# EAGLE schematic Day0_Yulian Deni_13215034 (EAGLE 7.5.0)
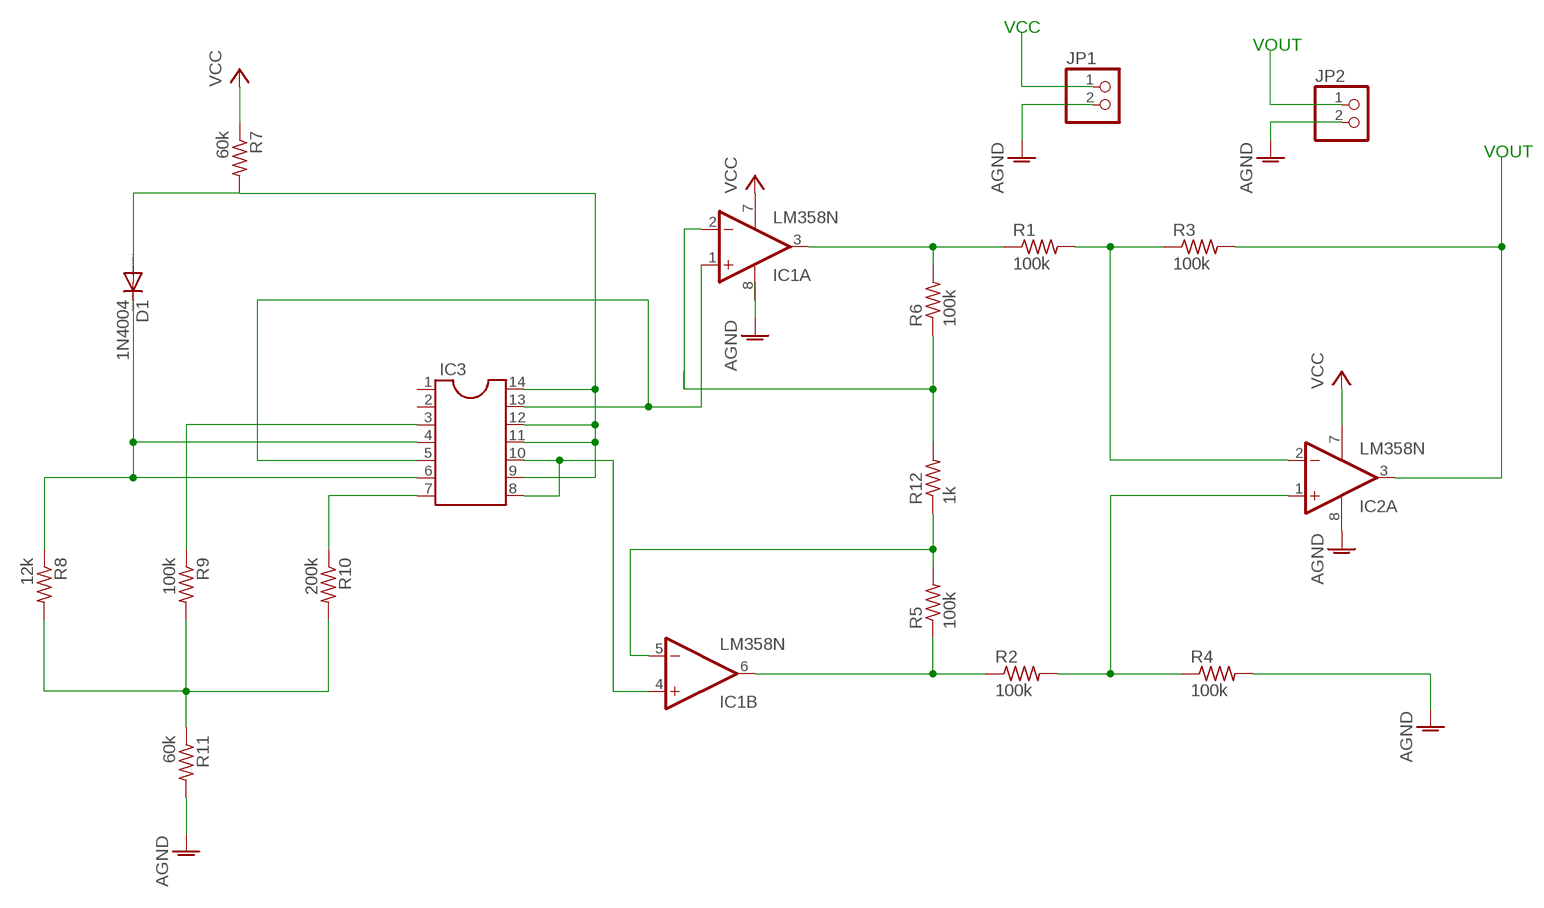
[diagram p0: schematic, sheet 1]

## Parts
D1  1N4004  [DO41-10]
IC1  LM358N  [DIL08]
IC2  LM358N  [DIL08]
IC3  DIL14  [DIL14]
JP1  PINHD-1X2  [1X02]
JP2  PINHD-1X2  [1X02]
R1  100k  R-US_0204/7  [0204/7]
R2  100k  R-US_0204/7  [0204/7]
R3  100k  R-US_0204/7  [0204/7]
R4  100k  R-US_0204/7  [0204/7]
R5  100k  R-US_0204/7  [0204/7]
R6  100k  R-US_0204/7  [0204/7]
R7  60k  R-US_0204/7  [0204/7]
R8  12k  R-US_0204/7  [0204/7]
R9  100k  R-US_0204/7  [0204/7]
R10  200k  R-US_0204/7  [0204/7]
R11  60k  R-US_0204/7  [0204/7]
R12  1k  R-US_0204/7  [0204/7]

## Nets
AGND: IC2.8(P:V-) JP1.2 JP2.2 R4.2 R11.2
N$1: D1.A IC3.9 IC3.11 IC3.12 IC3.14 R7.2
N$2: D1.C IC3.4 IC3.6 R8.1
N$3: IC3.7 R10.1
N$4: IC1.1(A:+IN) IC3.5 IC3.13
N$5: IC3.3 R9.1
N$6: R8.2 R9.2 R10.2 R11.1
N$7: IC1.4(B:+IN) IC3.8 IC3.10
N$8: IC1.3(A:OUT) R1.1 R6.2
N$9: R6.1 R12.2
N$10: IC1.5(B:-IN) R5.2 R12.1
N$11: IC1.6(B:OUT) R2.1 R5.1
N$12: IC2.2(A:-IN) R1.2 R3.1
N$13: IC1.2(A:-IN)
N$14: IC2.1(A:+IN) R2.2 R4.1
N$15: IC2.3(A:OUT) R3.2
N$16: JP1.1
N$17: JP2.1
VCC: IC1.7(P:V+) IC2.7(P:V+) R7.1
Unconnected: IC2.4(B:+IN) IC2.5(B:-IN) IC2.6(B:OUT) IC3.1 IC3.2

## Notes on the sheet
- VCC
- VOUT
- VOUT

## Power pins joined to a net without a drawn wire
V-: IC1.8(P:V-)

## Library data of the parts
D1 = diode:1N4004: DIODE general purpose rectifier, 1 A
IC1 IC2 = linear:LM358: OP AMP also LM158; LM258; LM2904 Source: http://cache.national.com/ds/LM/LM158.pdf
IC3 = ic-package:DIL14: Dual In Line / Socket
JP1 JP2 = pinhead:PINHD-1X2: PIN HEADER
R1-R12 = resistor:R-US_: RESISTOR, American symbol